# Altium schematic sheet RelayA.SchDoc
size A4
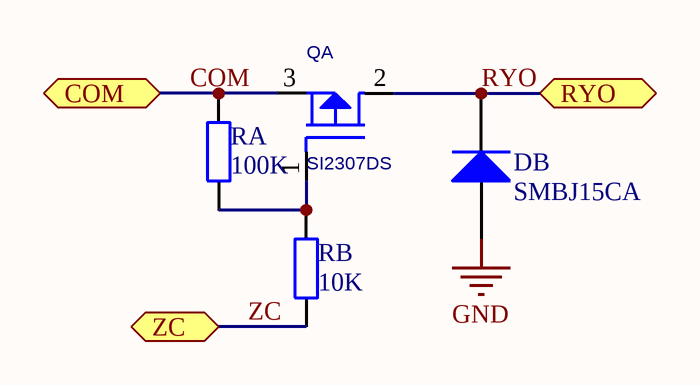
[diagram p0: RelayA.SchDoc]

## Parts
DB  SMBJ15CA  [SO-0.4A]
QA  SI2307DS  [SOT-23]
RA  value 100K  [R0603]
RB  value 10K  [R0603]

## Ports
COM (bidir), RYO (bidir), ZC (bidir)

## Nets
GND: DB.A
COM: QA.3(SOURCE) RA.2 ; port COM
RYO: DB.K QA.2(DRAIN) ; port RYO
ZC: RB.1 ; port ZC
NetQA_1: QA.1(GATE) RA.1 RB.2

## Library data of the parts
DB = Diode 1N4001: 1 Amp General Purpose Rectifier; Published: 8-Jun-2000; LatestRevisionDate: 17-Jul-2002; LatestRevisionNote: Re-released for DXP Platform.; DatasheetVersion: 1998; PackageVersion: Aug-1999; PackageReference: DO-41; Publisher: Altium Limited; PackageDescription: Diode, Axial; Body 5.2 x 2.7 mm (LxDia. max), Lead Dia. 0.86 mm (max); Code_JEDEC: DO-204-AL; ComponentLink1Description: Manufacturer Link; ComponentLink1URL: http://www.fairchildsemi.com/; ComponentLink2Description: Datasheet; ComponentLink2URL: http://www.fairchildsemi.com/ds/1N%2F1N4001.pdf
QA = MOSFET P_1
RA RB = Res2: Resistor; Published: 8-Jun-2000; LatestRevisionDate: 17-Jul-2002; LatestRevisionNote: Re-released for DXP Platform.; PackageReference: AXIAL-0.4; Publisher: Altium Limited; PackageDescription: Axial Device, Thru-Hole; 2 Leads; 0.4 in Pin Spacing